# Altium schematic sheet 04_Driver.SchDoc: -
size A3; Date: -; ApprovedBy: -; CheckedBy: -; Author: -; CompanyName: -; DrawnBy: -; Engineer: -; Organization: Komax AG; Address1: -; Address2: -; Address3: -; Address4: -; DocumentNumber: -; Revision: -; SheetNumber: 4; SheetTotal: 8; KSDP_ObjectName: Driver; KSDP_CreatedBy: Patrick Rossacher; KSDP_CreationDate: 15.12.2017; KSDP_ModificationDate: -; KSDP_ModifiedBy: -; CurrentTime: -; CurrentDate: -; Time: -; DocumentFullPathAndName: -; DocumentName: -; ModifiedDate: -; ImagePath: -
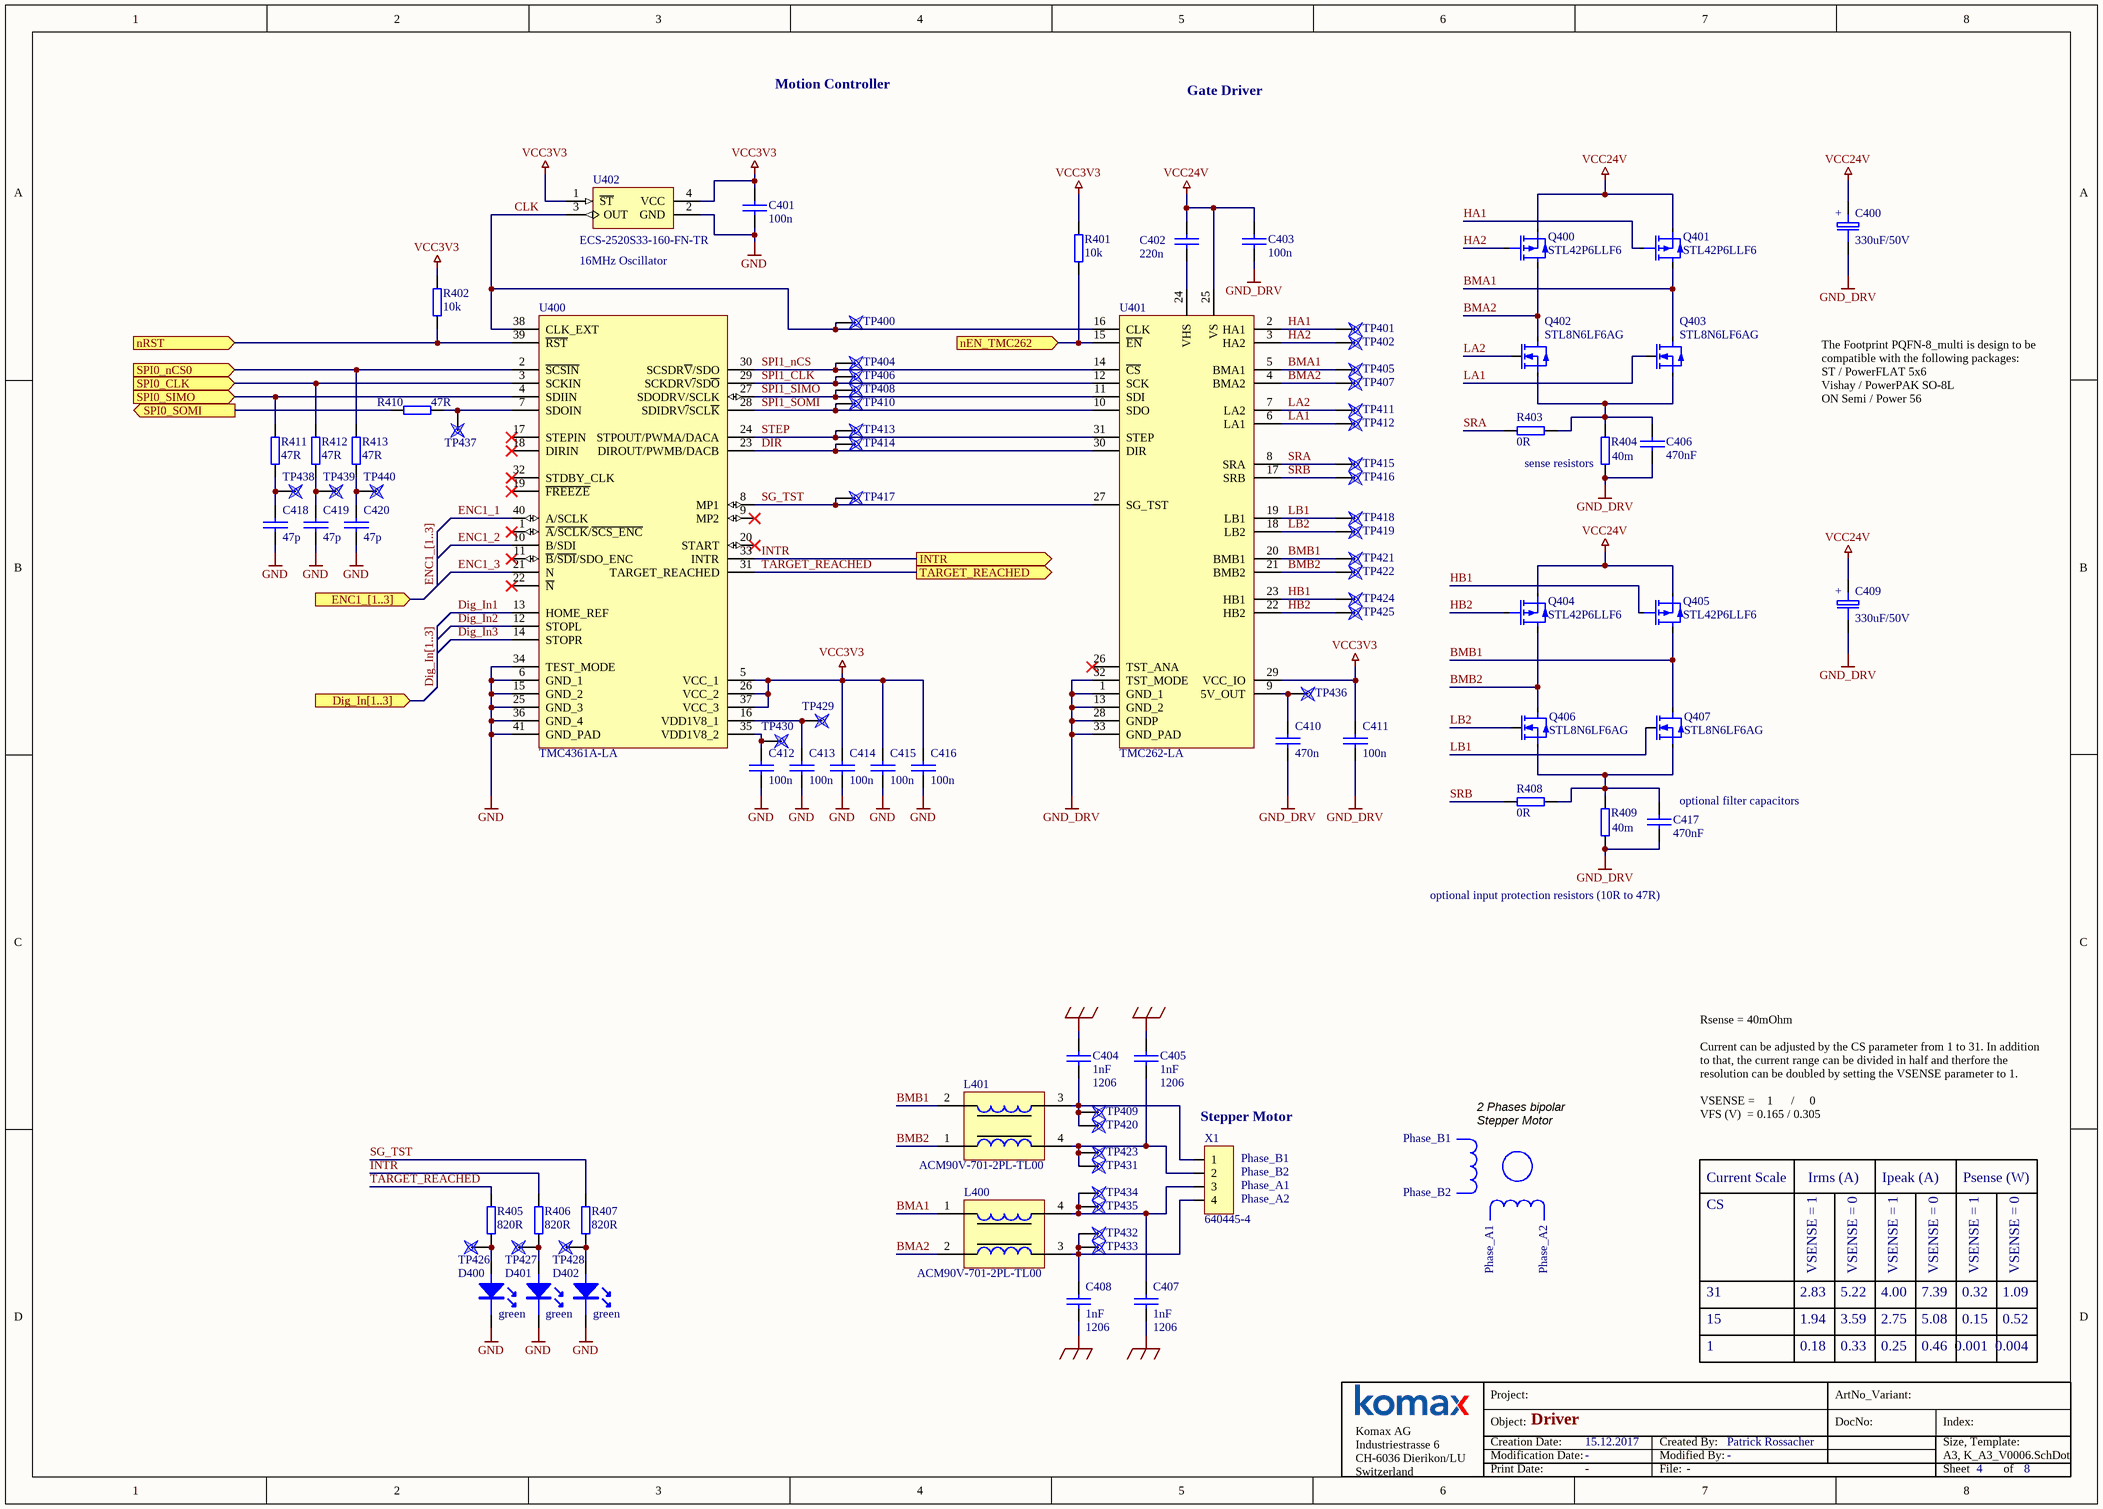
[diagram p0: 04_Driver.SchDoc]

## Parts
C400  330uF/50V  [SMD_Cap_Panasonic_H13]
C401  100n  [0402_C]
C402  220n  [0603_C]
C403  100n  [0402_C]
C404  1nF  FootprintBOM: 1206  [1206_C]
C405  1nF  FootprintBOM: 1206  [1206_C]
C406  470nF  [0603_C]
C407  1nF  FootprintBOM: 1206  [1206_C]
C408  1nF  FootprintBOM: 1206  [1206_C]
C409  330uF/50V  [SMD_Cap_Panasonic_H13]
C410  470n  [0603_C]
C411  100n  [0402_C]
C412  100n  [0402_C]
C413  100n  [0402_C]
C414  100n  [0402_C]
C415  100n  [0402_C]
C416  100n  [0402_C]
C417  470nF  [0603_C]
C418  47p  [0402_C]
C419  47p  [0402_C]
C420  47p  [0402_C]
D400  color: green  [0603_led]  (hidden comment: HSMG-C190)
D401  color: green  [0603_led]  (hidden comment: HSMG-C190)
D402  color: green  [0603_led]  (hidden comment: HSMG-C190)
L400  ACM90V-701-2PL-TL00  [ACM90V]
L401  ACM90V-701-2PL-TL00  [ACM90V]
Q400  STL42P6LLF6  [PQFN-8_Multi]
Q401  STL42P6LLF6  [PQFN-8_Multi]
Q402  STL8N6LF6AG  [PQFN-8_Multi]
Q403  STL8N6LF6AG  [PQFN-8_Multi]
Q404  STL42P6LLF6  [PQFN-8_Multi]
Q405  STL42P6LLF6  [PQFN-8_Multi]
Q406  STL8N6LF6AG  [PQFN-8_Multi]
Q407  STL8N6LF6AG  [PQFN-8_Multi]
R401  10k  [0402_R]
R402  10k  [0402_R]
R403  0R  [0402_R]
R404  value 40m  [2512_R]  (hidden comment: CRA2512-FZ-R040ELF)
R405  820R  [0402_R]
R406  820R  [0402_R]
R407  820R  [0402_R]
R408  0R  [0402_R]
R409  value 40m  [2512_R]  (hidden comment: CRA2512-FZ-R040ELF)
R410  47R  [0402_R]
R411  47R  [0402_R]
R412  47R  [0402_R]
R413  47R  [0402_R]
TP400  Testpoint  [TP1.5MM]  (value not drawn)  (no BOM)
TP401  Testpoint  [TP1.5MM]  (value not drawn)  (no BOM)
TP402  Testpoint  [TP1.5MM]  (value not drawn)  (no BOM)
TP404  Testpoint  [TP1.5MM]  (value not drawn)  (no BOM)
TP405  Testpoint  [TP1.5MM]  (value not drawn)  (no BOM)
TP406  Testpoint  [TP1.5MM]  (value not drawn)  (no BOM)
TP407  Testpoint  [TP1.5MM]  (value not drawn)  (no BOM)
TP408  Testpoint  [TP1.5MM]  (value not drawn)  (no BOM)
TP409  Testpoint  [TP1.5MM]  (value not drawn)  (no BOM)
TP410  Testpoint  [TP1.5MM]  (value not drawn)  (no BOM)
TP411  Testpoint  [TP1.5MM]  (value not drawn)  (no BOM)
TP412  Testpoint  [TP1.5MM]  (value not drawn)  (no BOM)
TP413  Testpoint  [TP1.5MM]  (value not drawn)  (no BOM)
TP414  Testpoint  [TP1.5MM]  (value not drawn)  (no BOM)
TP415  Testpoint  [TP1.5MM]  (value not drawn)  (no BOM)
TP416  Testpoint  [TP1.5MM]  (value not drawn)  (no BOM)
TP417  Testpoint  [TP1.5MM]  (value not drawn)  (no BOM)
TP418  Testpoint  [TP1.5MM]  (value not drawn)  (no BOM)
TP419  Testpoint  [TP1.5MM]  (value not drawn)  (no BOM)
TP420  Testpoint  [TP1.5MM]  (value not drawn)  (no BOM)
TP421  Testpoint  [TP1.5MM]  (value not drawn)  (no BOM)
TP422  Testpoint  [TP1.5MM]  (value not drawn)  (no BOM)
TP423  Testpoint  [TP1.5MM]  (value not drawn)  (no BOM)
TP424  Testpoint  [TP1.5MM]  (value not drawn)  (no BOM)
TP425  Testpoint  [TP1.5MM]  (value not drawn)  (no BOM)
TP426  Testpoint  [TP1.5MM]  (value not drawn)  (no BOM)
TP427  Testpoint  [TP1.5MM]  (value not drawn)  (no BOM)
TP428  Testpoint  [TP1.5MM]  (value not drawn)  (no BOM)
TP429  Testpoint  [TP1.5MM]  (value not drawn)  (no BOM)
TP430  Testpoint  [TP1.5MM]  (value not drawn)  (no BOM)
TP431  Testpoint  [TP1.5MM]  (value not drawn)  (no BOM)
TP432  Testpoint  [TP1.5MM]  (value not drawn)  (no BOM)
TP433  Testpoint  [TP1.5MM]  (value not drawn)  (no BOM)
TP434  Testpoint  [TP1.5MM]  (value not drawn)  (no BOM)
TP435  Testpoint  [TP1.5MM]  (value not drawn)  (no BOM)
TP436  Testpoint  [TP1.5MM]  (value not drawn)  (no BOM)
TP437  Testpoint  [TP1.5MM]  (value not drawn)  (no BOM)
TP438  Testpoint  [TP1.5MM]  (value not drawn)  (no BOM)
TP439  Testpoint  [TP1.5MM]  (value not drawn)  (no BOM)
TP440  Testpoint  [TP1.5MM]  (value not drawn)  (no BOM)
U400  TMC4361A-LA  [TMC_QFN40_0.5_6.0X6.0]
U401  TMC262-LA  [TMC_QFN32_0.5_5.0X5.0]
U402  ECS-2520S33-160-FN-TR  [SMD_LPO_2.5x2mm]
X1  640445-4  [CON_THT_4P_MTA-156]

## Ports
Dig_In[1..3] (in), ENC1_[1..3] (in), INTR (out), nEN_TMC262 (in), nRST (in), SPI0_CLK (in), SPI0_nCS0 (in), SPI0_SIMO (in), SPI0_SOMI (out), TARGET_REACHED (out)

## Nets
GND: C401.2 C412.1 C413.1 C414.1 C415.1 C416.1 C418.1 C419.1 C420.1 D400.K D401.K D402.K U400.6(GND_1) U400.15(GND_2) U400.25(GND_3) U400.34(TEST_MODE) U400.36(GND_4) U400.41(GND_PAD) U402.2(GND)
GND_DRV: C400.2 C403.1 C406.2 C409.2 C410.1 C411.1 C417.1 R404.1 R409.2 U401.1(GND_1) U401.13(GND_2) U401.28(GNDP) U401.32(TST_MODE) U401.33(GND_PAD)
Shield_1: C407.1 C408.1
Shield_4: C404.1 C405.1
VCC3V3: C401.1 C411.2 C414.2 C415.2 C416.2 R401.2 R402.2 U400.5(VCC_1) U400.26(VCC_2) U400.37(VCC_3) U401.29(VCC_IO) U402.1(~{ST}) U402.4(VCC)
VCC24V: C400.1 C402.2 C403.2 C409.1 Q400.S Q401.S Q404.S Q405.S U401.25(VS)
BMA1: L400.1 Q401.D Q403.D TP405.1 U401.5(BMA1)
BMA2: L400.2 Q400.D Q402.D TP407.1 U401.4(BMA2)
BMB1: L401.2 Q405.D Q407.D TP421.1 U401.20(BMB1)
BMB2: L401.1 Q404.D Q406.D TP422.1 U401.21(BMB2)
CLK: TP400.1 U400.38(CLK_EXT) U401.16(CLK) U402.3(OUT)
Dig_In1: U400.13(HOME_REF)
Dig_In2: U400.12(STOPL)
Dig_In3: U400.14(STOPR)
DIR: TP414.1 U400.23(DIROUT/PWMB/DACB) U401.30(DIR)
ENC1_1: U400.40(A/SCLK)
ENC1_2: U400.10(B/SDI)
ENC1_3: U400.21(N)
HA1: Q401.G TP401.1 U401.2(HA1)
HA2: Q400.G TP402.1 U401.3(HA2)
HB1: Q405.G TP424.1 U401.23(HB1)
HB2: Q404.G TP425.1 U401.22(HB2)
INTR: R406.2 U400.33(INTR) ; port INTR
LA1: Q403.G TP412.1 U401.6(LA1)
LA2: Q402.G TP411.1 U401.7(LA2)
LB1: Q407.G TP418.1 U401.19(LB1)
LB2: Q406.G TP419.1 U401.18(LB2)
nEN_TMC262: R401.1 U401.15(~{EN}) ; port nEN_TMC262
nRST: R402.1 U400.39(~{RST}) ; port nRST
SG_TST: R407.2 TP417.1 U400.8(MP1) U401.27(SG_TST)
SPI0_CLK: R412.2 U400.3(SCKIN) ; port SPI0_CLK
SPI0_nCS0: R413.2 U400.2(~{SCSIN}) ; port SPI0_nCS0
SPI0_SIMO: R411.2 U400.4(SDIIN) ; port SPI0_SIMO
SPI0_SOMI: R410.2 ; port SPI0_SOMI
SPI1_CLK: TP406.1 U400.29(SCKDRV~{/}SD~{O}) U401.12(SCK)
SPI1_nCS: TP404.1 U400.30(SCSDR~{V}/SDO) U401.14(~{CS})
SPI1_SIMO: TP408.1 U400.27(SDODRV/SCLK) U401.11(SDI)
SPI1_SOMI: TP410.1 U400.28(SDIDRV~{/}SCL~{K}) U401.10(SDO)
SRA: R403.2 TP415.1 U401.8(SRA)
SRB: R408.1 TP416.1 U401.17(SRB)
STEP: TP413.1 U400.24(STPOUT/PWMA/DACA) U401.31(STEP)
TARGET_REACHED: R405.2 U400.31(TARGET_REACHED) ; port TARGET_REACHED
NetC402_1: C402.1 U401.24(VHS)
NetC404_2: C404.2 L401.3 TP409.1 TP420.1 X1.1
NetC405_2: C405.2 L401.4 TP423.1 TP431.1 X1.2
NetC406_1: C406.1 Q402.S Q403.S R403.1 R404.2
NetC407_2: C407.2 L400.4 TP434.1 TP435.1 X1.3
NetC408_2: C408.2 L400.3 TP432.1 TP433.1 X1.4
NetC410_2: C410.2 TP436.1 U401.9(5V_OUT)
NetC412_2: C412.2 TP430.1 U400.35(VDD1V8_2)
NetC413_2: C413.2 TP429.1 U400.16(VDD1V8_1)
NetC417_2: C417.2 Q406.S Q407.S R408.2 R409.1
NetC418_2: C418.2 R411.1 TP438.1
NetC419_2: C419.2 R412.1 TP439.1
NetC420_2: C420.2 R413.1 TP440.1
NetD400_A: D400.A R405.1 TP426.1
NetD401_A: D401.A R406.1 TP427.1
NetD402_A: D402.A R407.1 TP428.1
NetR410_1: R410.1 TP437.1 U400.7(SDOIN)

Not connected (* = marked no-connect by the designer): U400 1(~{A}/~{SCLK}/~{SCS_ENC})* 9(MP2)* 11(~{B}/~{SDI}/SDO_ENC)* 17(STEPIN)* 18(DIRIN)* 19(~{FREEZE})* 20(START)* 22(~{N})* 32(STDBY_CLK)*; U401 26(TST_ANA)*

## Buses and harness runs
bus Dig_In[1..3] = port Dig_In[1..3]
bus ENC1_[1..3] = port ENC1_[1..3]

## Notes on the sheet
- Motion Controller
- Gate Driver
- 16MHz Oscillator
- The Footprint PQFN-8_multi is design to be compatible with the following packages:
  ST / PowerFLAT 5x6
  Vishay / PowerPAK SO-8L
  ON Semi / Power 56
- (near R404) sense resistors
- (near C417) optional filter capacitors
- optional input protection resistors (10R to 47R)
- (near X1) Stepper Motor
- (near X1) Phase_B1
- (near X1) Phase_B2
- (near X1) Phase_A1
- Phase_B1
- 2 Phases bipolar Stepper Motor
- Rsense = 40mOhm
  Current can be adjusted by the CS parameter from 1 to 31. In addition to that, the current range can be divided in half and therfore the resolution can be doubled by setting the VSENSE parameter to 1.
  VSENSE =    1      /     0
  VFS (V)  = 0.165 / 0.305
- Current Scale
- Irms (A)
- Ipeak (A)
- Psense (W)
- (near X1) Phase_A2
- Phase_B2
- CS
- Phase_A1
- Phase_A2
- 15
- 31
- VSENSE = 1
- 1.94
- 2.83
- VSENSE = 0
- 5.22
- 3.59
- 2.75
- 4.00
- 7.39
- 5.08
- 0.15
- 0.32
- 1.09
- 0.52
- 1
- 0.18
- 0.33
- 0.25
- 0.46
- 0.001
- 0.004
- Project:
- ArtNo_Variant:
- Object:
- Creation Date:
- Modification Date:
- Created By:
- Modified By:
- DocNo:
- Index:
- Size, Template:
- A3, K_A3_V0006.SchDot
- Komax AG
  Industriestrasse 6
  CH-6036 Dierikon/LU
  Switzerland
- Print Date:
- File:
- Sheet
- of
- (in symbol C_EL_220UF/50V) +

## Library data of the parts
C400 C409 = C_EL_220UF/50V: EEVFK1H331Q; Manufacturer: Panasonic; Spannung: 50V; Strategic: 0; Bezeichnung: EEVFK1H331Q
C401 C404 C405 C407 C408 = CAP: Ceramic Capacitor >=50V X7R
  C401: FootprintBOM: 0402
C402 C403 C410-C416 C418-C420 = Cap: Ceramic Capacitor >=50V X7R
  C402 C410: FootprintBOM: 0603
  C403 C411-C416 C418-C420: FootprintBOM: 0402
C406 C417 = CAP: Ceramic Capacitor >=25V; FootprintBOM: 0603
D400-D402 = LED: SMD LED green; Manufacturer: AVAGO; Forward Voltage: 2.2V
L400 L401 = ACM1211-701-2PL-TL01: Common Mode Chokes Dual 700Ohm 100MHz 5A 10mOhm DCR SMD T/R; Manufacturer: TDK; FootprintBOM: ACM90V
Q400 Q401 Q404 Q405 = MOSFET-P 1G,2x,3S,4D (Diode): P-Channel Power MOSFET, -60V; 3rdSource: FDMS86163P; MaxTemp: 175; MinTemp: -50; 2ndSourcesReleased: DMP6050SPS-13; Bemerkung: *; Distributor: *; FootprintBOM: *; Manufacturer: *; Notes: *; Reference: *; Strategic: *
Q402 Q403 Q406 Q407 = MOSFET-N 1G,4D,3S (Diode): N-Channel Power MOSFET, 60V; 3rdSource: FDMS86183; MaxTemp: 175; MinTemp: -50; 2ndSourcesReleased: DMT6016LPS-13
R401-R403 R405-R408 R410-R413 = RES2: Resistor 0.063W 1%; FootprintBOM: 0402
R404 R409 = RES2: Resistor 40m / 3W 1%; Manufacturer: Bourns; MaxTemp: 170; MinTemp: -55; 2ndSourcesReleased: YAG2173DKR-ND; FootprintBOM: 2512; Bemerkung: CRA2512-FZ-R040ELF; max. Verlustleistung: 3W
TP400-TP402 TP404-TP440 = P_PRUEFPAD: FootprintBOM: Testpoint
U400 = TMC4361A-LA: S-ramp motion controller for stepper motors with high velocities. With SPI and Step/Dir; QFN40(5x5); Manufacturer: TRINAMIC; Geometry.Height: 0.9mm; Datasheet: *; Distributor#1: *; Distributor#2: *; Ordercode - Distri#1: *; Ordercode - Distri#2: *; Ordercode - Manu#1: TMC4361A-LA; Value: TMC4361A-LA
U401 = TMC262-LA: Energy saving high resolution microstepping two phase stepper driver with Step/Dir, SPI, up to 60V, QFN32(5x5); Manufacturer: TRINAMIC; Geometry.Height: 0,9mm; Ordercode - Distri#1: 1460-1044-ND; Ordercode - Distri#2: 1858307; Datasheet: http://www.trinamic.com/_scripts/download.php?file=_articles%2Fproducts%2Fintegrated-circuits%2Ftmc262%2F_datasheet%2FTMC262_datasheet.pdf; Distributor#1: Digikey; Distributor#2: Farnell; Ordercode - Manu#1: TMC262-LA; Value: TMC262-LA
U402 = OSCILATOR4: MEMS Oscillator 16MHz 3,3V -40/+85°C; Manufacturer: ECS; FootprintBOM: SMD 2.5x2mm
X1 = CON_4P: MTA-156 Plug Connector 180° 4P 3.96mm